# EasyEDA Pro project load_module.epro

# Schematic Adapter Tester Load Module
Board Name: Load Module; Create Date: 2025-03-27; Page Name: P1; Project Name: Adapter Tester; Schematic Name: Adapter Tester Load Module; Update Date: 2025-04-22; Company: FIIT STU; Page Size: A4; Version: V6.1
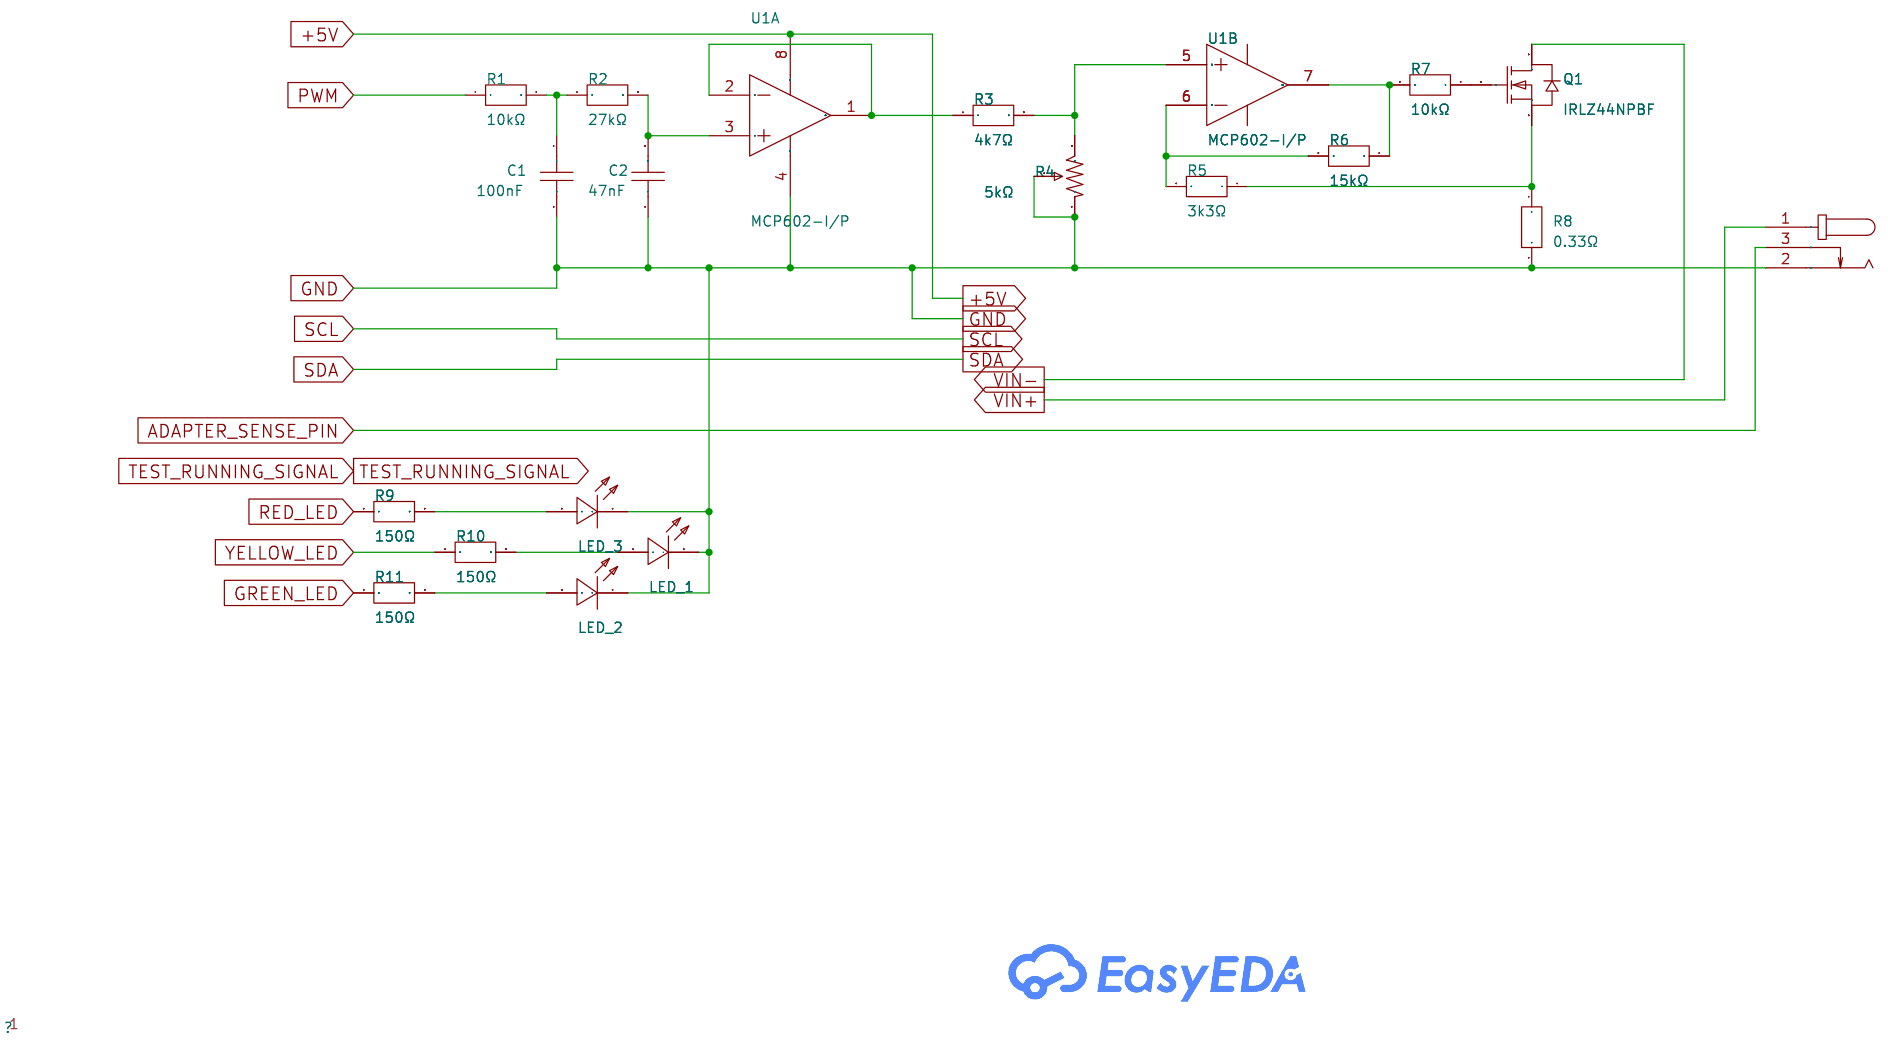
[diagram p0: schematic sheet]

## Parts
BARREL_PLUG  BARREL_PLUG  [DC-IN-TH_DC-005-2]
C1  100nF  [CAP-TH_L5.8-W2.4-P2.54-D0.6]
C2  47nF  [CAP-TH_L5.8-W2.4-P2.54-D0.6]
LED1  LED_1  [LED0805-R-RD]
LED_2  LED_2  [LED0603-RD]
LED_3  LED_3  [LED0603-RD]
Q1  IRLZ44NPBF  [TO-220-3_L10.0-W4.5-P2.54-T]
R1  10kΩ  [RES-TH_BD3.9-L9.0-P13.00-D0.8]
R2  27kΩ  [RES-TH_BD3.9-L9.0-P13.00-D0.8]
R3  4k7Ω  [RES-TH_BD3.9-L9.0-P13.00-D0.8]
R4  5kΩ  [RES-ADJ-TH_3P-L5.0-W4.5_ST-4ECXXX]
R5  3k3Ω  [RES-TH_BD3.9-L9.0-P13.00-D0.8]
R6  15kΩ  [RES-TH_BD3.9-L9.0-P13.00-D0.8]
R7  10kΩ  [RES-TH_BD3.9-L9.0-P13.00-D0.8]
R8  0.33Ω  [RES-TH_BD3.9-L9.0-P13.00-D0.8]
R9  150Ω  [RES-TH_BD3.9-L9.0-P13.00-D0.8]
R10  150Ω  [RES-TH_BD3.9-L9.0-P13.00-D0.8]
R11  150Ω  [RES-TH_BD3.9-L9.0-P13.00-D0.8]
U1  MCP602-I/P  [PDIP-8_L10.2-W6.5-P2.54-LS7.6-BL]  (sections 1,2)

## Library data of the parts
BARREL_PLUG = DC-005-5.5*2.1: Supplier Part: C9900017044; Supplier Footprint: DC-005; JLCPCB Part Class: Extended Part; Supplier: LCSC
C1 C2 = CC1H104ZA1PD3F5O3100: Capacitance:100nF Tolerance:-20%~+80% Tolerance:-20%~+80% Voltage Rated: Lead Spacing: Temperature Coefficient: φD: Body Thickness:2.7mm; LCSC Part Name: 100nF -20%~+80% 50V; Supplier Part: C5442938; Manufacturer: Dersonic(德尔创); Supplier Footprint: 插件,P=2.54mm; JLCPCB Part Class: Extended Part; Datasheet: https://atta.szlcsc.com/upload/public/pdf/source/20240808/A1D643912CF02E8A3453BB78D66C3C25.pdf; Supplier: LCSC; Tolerance: -20%~+80%; Body Thickness: 2.7mm
LED1 = KT-0805Y: Emitted Color:Yellow Power Dissipation:- Forward Current:- Dominant Wavelength:- Dominant Wavelength:- Peak Wavelength:- Diode Configuration:- Lens Color:- Color Temperature:- Color Temperature:- Viewing Angle:- Mounting Sytle:- Operating Temperature:- Op; LCSC Part Name: 0805 黄灯 高亮; Supplier Part: C2296; Manufacturer: KENTO; Supplier Footprint: 0805; JLCPCB Part Class: Basic Part; Datasheet: https://atta.szlcsc.com/upload/public/pdf/source/20160421/1461205044170.pdf; Supplier: LCSC; Emitted Color: Yellow
LED_2 LED_3 = KT-0603R: Emitted Color:Red Power Dissipation:- Forward Current:- Dominant Wavelength:- Dominant Wavelength:- Peak Wavelength:- Diode Configuration:- Lens Color:- Color Temperature:- Color Temperature:- Viewing Angle:- Mounting Sytle:- Operating Temperature:-40℃~+8; LCSC Part Name: 0603 红灯 高亮; Supplier Part: C2286; Manufacturer: KENTO; Supplier Footprint: 0603; JLCPCB Part Class: Basic Part; Datasheet: https://atta.szlcsc.com/upload/public/pdf/source/20160616/1466072038404.pdf; Supplier: LCSC; Emitted Color: Red; Operating Temperature: -40℃~+85℃
Q1 = IRLZ44NPBF: Type:1 N-Channel Drain Source Voltage (Vdss): Continuous Drain Current (Id): Drain Source On Resistance (RDS(on)@Vgs,Id):0.025Ω@5.0V,25A Power Dissipation (Pd): Gate Threshold Voltage (Vgs(th)@Id):1V@250uA Total Gate Charge (Qg@Vgs):48nC Input Capacitance; LCSC Part Name: 1个N沟道 耐压:55V 电流:47A; Supplier Part: C38774; Manufacturer: Infineon(英飞凌); Supplier Footprint: TO-220AB; JLCPCB Part Class: Extended Part; Datasheet: https://atta.szlcsc.com/upload/public/pdf/source/20141125/1457707250505.pdf; Supplier: LCSC; Type: 1 N-Channel; Drain Source On Resistance (RDS(on)@Vgs,Id): 0.025Ω@5.0V,25A; Gate Threshold Voltage (Vgs(th)@Id): 1V@250uA; Total Gate Charge (Qg@Vgs): 48nC; Input Capacitance (Ciss@Vds): 1.7nF; Reverse Transfer Capacitance (Crss@Vds): 150pF; Operating Temperature: -55℃~+175℃
R1-R3 R5-R11 = FMP200FBE52-11K: Type:Metal Film Resistors Resistance:11kΩ Tolerance:±1% Tolerance:±1% Power(Watts):2W Temperature Coefficient:±50ppm/℃ Temperature Coefficient:±50ppm/℃ Operating Temperature:-55℃~+155℃ Operating Temperature:-55℃~+155℃; LCSC Part Name: 金属膜电阻 11kΩ ±1% 2W; Supplier Part: C1381389; Manufacturer: YAGEO(国巨); Supplier Footprint: 插件,D3.9xL9mm; JLCPCB Part Class: Extended Part; Datasheet: https://atta.szlcsc.com/upload/public/pdf/source/20201103/C914809_0FD47FD0CF8094ED124D19117FE060E1.pdf; Supplier: LCSC; Type: Metal Film Resistors; Tolerance: ±1%; Power(Watts): 2W; Temperature Coefficient: ±50ppm/℃; Operating Temperature: -55℃~+155℃
R4 = ST-42EC502: Resistance:5kΩ Tolerance:±20% Tolerance:±20% Power(Watts):0.25W Temperature Coefficient:±100ppm/℃ Temperature Coefficient:±100ppm/℃ Number of Turns:; LCSC Part Name: 5kΩ ±20%; Supplier Part: C7322415; Manufacturer: NIDEC(尼得科); Supplier Footprint: 插件; JLCPCB Part Class: Extended Part; Datasheet: https://atta.szlcsc.com/upload/public/pdf/source/231023/st-4.pdf-0aa63f559c046985194fcb42fa26b14b.pdf; Supplier: LCSC; Tolerance: ±20%; Power(Watts): 0.25W; Temperature Coefficient: ±100ppm/℃
U1 = MCP602-I/P: Number of Circuits:双路 Gain Bandwidth Product(GBP):2.8MHz Current - Input Bias(Ib):1pA Slew Rate(SR):2.3V/us Output Current:22mA -3db Bandwidth:- Output Type:- Rail to Rail:- Operating Temperature:-40℃~+85℃ Operating Temperature:-40℃~+85℃; Supplier Part: C640402; Manufacturer: MICROCHIP(美国微芯); Supplier Footprint: PDIP-8; JLCPCB Part Class: Extended Part; Datasheet: https://atta.szlcsc.com/upload/public/pdf/source/20200709/C640402_411BEB0B9160A10FACDB2D346531642E.pdf; Supplier: LCSC; Number of Circuits: 双路; Gain Bandwidth Product(GBP): 2.8MHz; Current - Input Bias(Ib): 1pA; Slew Rate(SR): 2.3V/us; Output Current: 22mA; Operating Temperature: -40℃~+85℃

## Nets
+5V: U1.8(VDD)
GND: BARREL_PLUG.2 C1.2 C2.1 LED1.2(-) LED_2.1(K) LED_3.1(K) R4.1 R4.2 R8.2 U1.4(VSS)
VIN+: BARREL_PLUG.1
VIN-: Q1.2(D)
ADAPTER_SENSE_PIN: BARREL_PLUG.3
GREEN_LED: R11.1
PWM: R1.1
RED_LED: R9.1
YELLOW_LED: R10.1
$1N5473: C1.1 R1.2 R2.1
$1N5911: R3.1 U1.1(OUTA) U1.2(INA-)
$1N6087: R3.2 R4.3 U1.5(INB+)
$1N6622: R5.2 R6.2 U1.6(INB-)
$1N6676: R6.1 R7.2 U1.7(OUTB)
$1N6802: Q1.1(G) R7.1
$1N7065: Q1.3(S) R5.1 R8.1
$1N7235: LED1.1(+) R10.2
$1N7867: C2.2 R2.2 U1.3(INA+)
Net-(LED_2-2): LED_2.2(A) R11.2
Net-(LED_3-2): LED_3.2(A) R9.2

# Schematic Old Load Module
Create Date: 2025-05-05; Page Name: P1; Project Name: Adapter Tester; Schematic Name: Old Load Module; Update Date: 2025-05-05; Company: EasyEDA.com; Page Size: A4; Version: V1.0
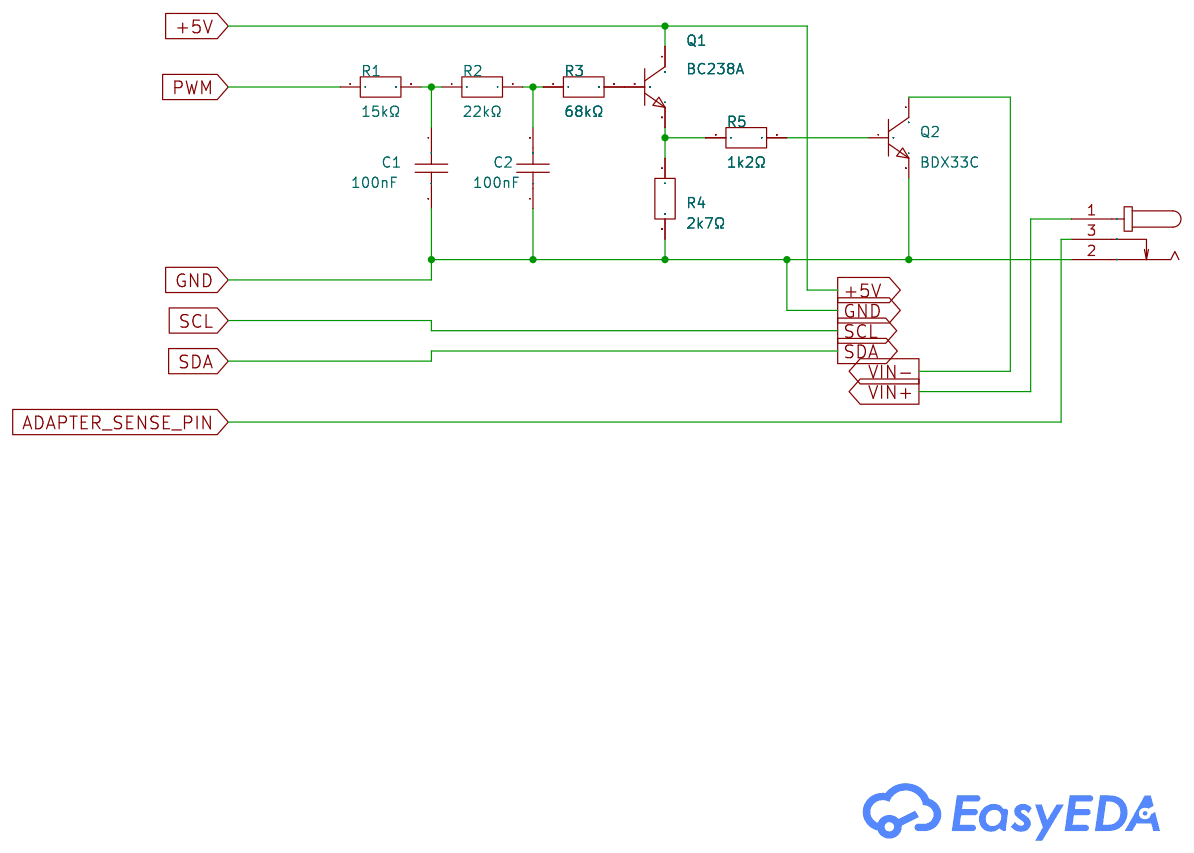
[diagram p1: schematic sheet]

## Parts
BARREL_PLUG1  BARREL_PLUG  [DC-IN-TH_DC-005-2]
C1  100nF  [CAP-TH_L5.8-W2.4-P2.54-D0.6]
C2  100nF  [CAP-TH_L5.8-W2.4-P2.54-D0.6]
Q1  BC238A  [TO-92-3_L4.8-W3.7-P1.27-L-1]
Q2  BDX33C  [TO-220-3_L10.0-W4.5-P2.54-L]
R1  15kΩ  [RES-TH_BD3.9-L9.0-P13.00-D0.8]
R2  22kΩ  [RES-TH_BD3.9-L9.0-P13.00-D0.8]
R3  68kΩ  [RES-TH_BD3.9-L9.0-P13.00-D0.8]
R4  2k7Ω  [RES-TH_BD3.9-L9.0-P13.00-D0.8]
R5  1k2Ω  [RES-TH_BD3.9-L9.0-P13.00-D0.8]

## Library data of the parts
BARREL_PLUG1 = DC-005-5.5*2.1: Supplier Part: C9900017044; Supplier Footprint: DC-005; JLCPCB Part Class: Extended Part; Supplier: LCSC
C1 C2 = CC1H104ZA1PD3F5O3100: Capacitance:100nF Tolerance:-20%~+80% Tolerance:-20%~+80% Voltage Rated: Lead Spacing: Temperature Coefficient: φD: Body Thickness:2.7mm; LCSC Part Name: 100nF -20%~+80% 50V; Supplier Part: C5442938; Manufacturer: Dersonic(德尔创); Supplier Footprint: 插件,P=2.54mm; JLCPCB Part Class: Extended Part; Datasheet: https://atta.szlcsc.com/upload/public/pdf/source/20240808/A1D643912CF02E8A3453BB78D66C3C25.pdf; Supplier: LCSC; Tolerance: -20%~+80%; Body Thickness: 2.7mm
Q1 = BC238A: Transistor type: Collector Current (Ic): Collector-Emitter Breakdown Voltage (Vceo): Power Dissipation (Pd): DC Current Gain (hFE@Ic,Vce):120@2mA,5V DC Current Gain (hFE@Ic,Vce):120@2mA,5V Transition Frequency (fT):250MHz Collector Cut-Off Current (Icbo):; Supplier Part: C3201868; Manufacturer: onsemi(安森美); Supplier Footprint: TO-92-3; JLCPCB Part Class: Extended Part; Datasheet: https://atta.szlcsc.com/upload/public/pdf/source/20230915/4ADCA7102CA9D64A631B24E57EEB097E.pdf; Supplier: LCSC; DC Current Gain (hFE@Ic,Vce): 120@2mA,5V; Transition Frequency (fT): 250MHz; Collector Cut-Off Current (Icbo): 15nA; Collector-Emitter Saturation Voltage (VCE(sat)@Ic,Ib): 600mV@100mA,5mA
Q2 = BDX33C: Supplier Part: C2907815; Manufacturer: SPTECH(深圳质超); Supplier Footprint: TO-220C; JLCPCB Part Class: Extended Part; Datasheet: https://atta.szlcsc.com/upload/public/pdf/source/20241108/8611D328D8F8F14D5B1655153493955F.pdf; Supplier: LCSC
R1-R5 = FMP200FBE52-11K: Type:Metal Film Resistors Resistance:11kΩ Tolerance:±1% Tolerance:±1% Power(Watts):2W Temperature Coefficient:±50ppm/℃ Temperature Coefficient:±50ppm/℃ Operating Temperature:-55℃~+155℃ Operating Temperature:-55℃~+155℃; LCSC Part Name: 金属膜电阻 11kΩ ±1% 2W; Supplier Part: C1381389; Manufacturer: YAGEO(国巨); Supplier Footprint: 插件,D3.9xL9mm; JLCPCB Part Class: Extended Part; Datasheet: https://atta.szlcsc.com/upload/public/pdf/source/20201103/C914809_0FD47FD0CF8094ED124D19117FE060E1.pdf; Supplier: LCSC; Type: Metal Film Resistors; Tolerance: ±1%; Power(Watts): 2W; Temperature Coefficient: ±50ppm/℃; Operating Temperature: -55℃~+155℃

## Nets
+5V: Q1.1(C)
GND: BARREL_PLUG1.2 C1.2 C2.1 Q2.3(E) R4.2
VIN+: BARREL_PLUG1.1
VIN-: Q2.2(C)
ADAPTER_SENSE_PIN: BARREL_PLUG1.3
PWM: R1.1
Net-(C1-1): C1.1 R1.2 R2.1
Net-(C2-2): C2.2 R2.2 R3.1
Net-(Q1-2): Q1.2(B) R3.2
Net-(Q1-3): Q1.3(E) R4.1 R5.1
Net-(Q2-1): Q2.1(B) R5.2

# Board PCB4
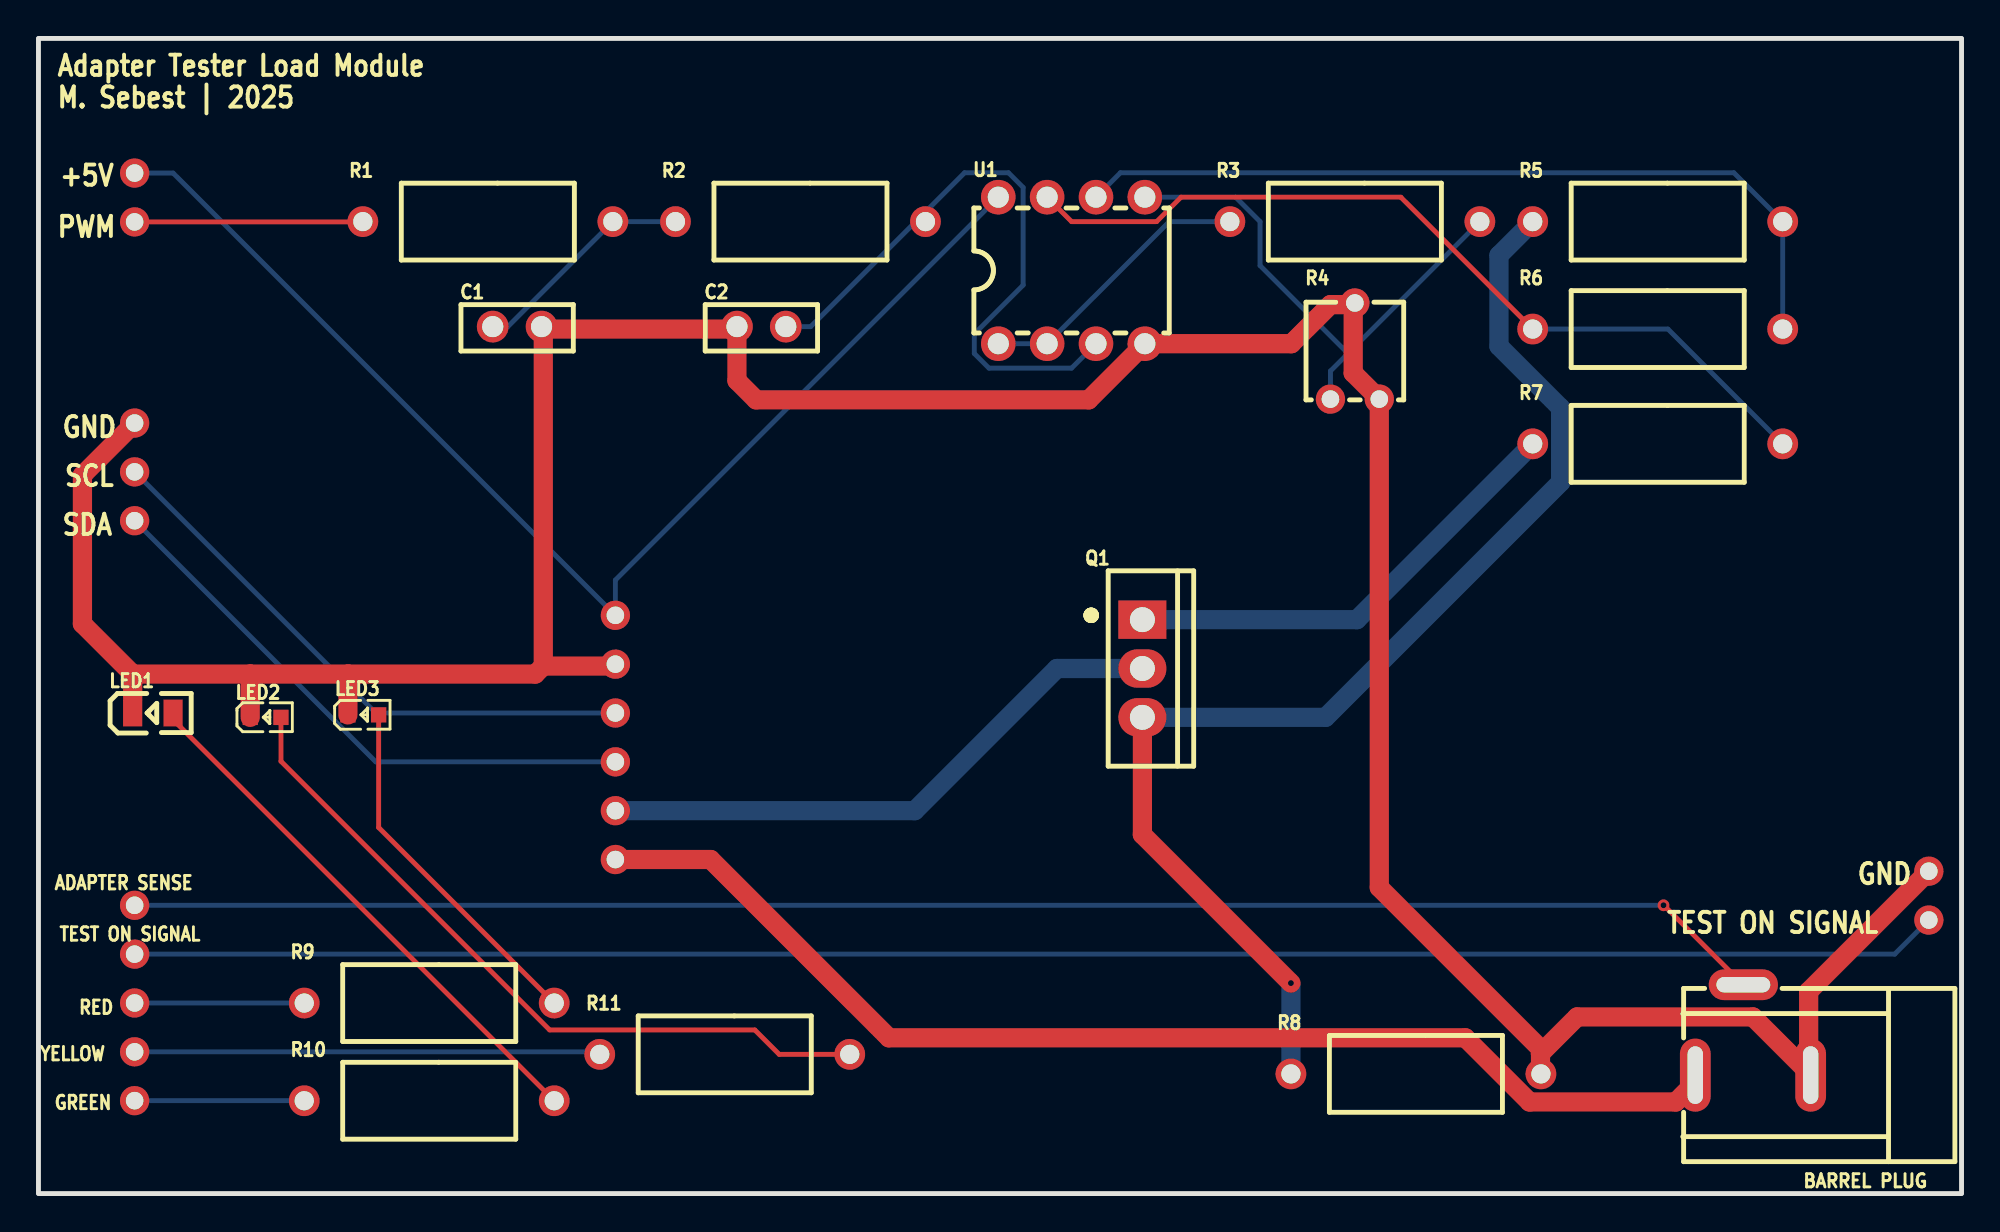
[diagram p2: board, top side]
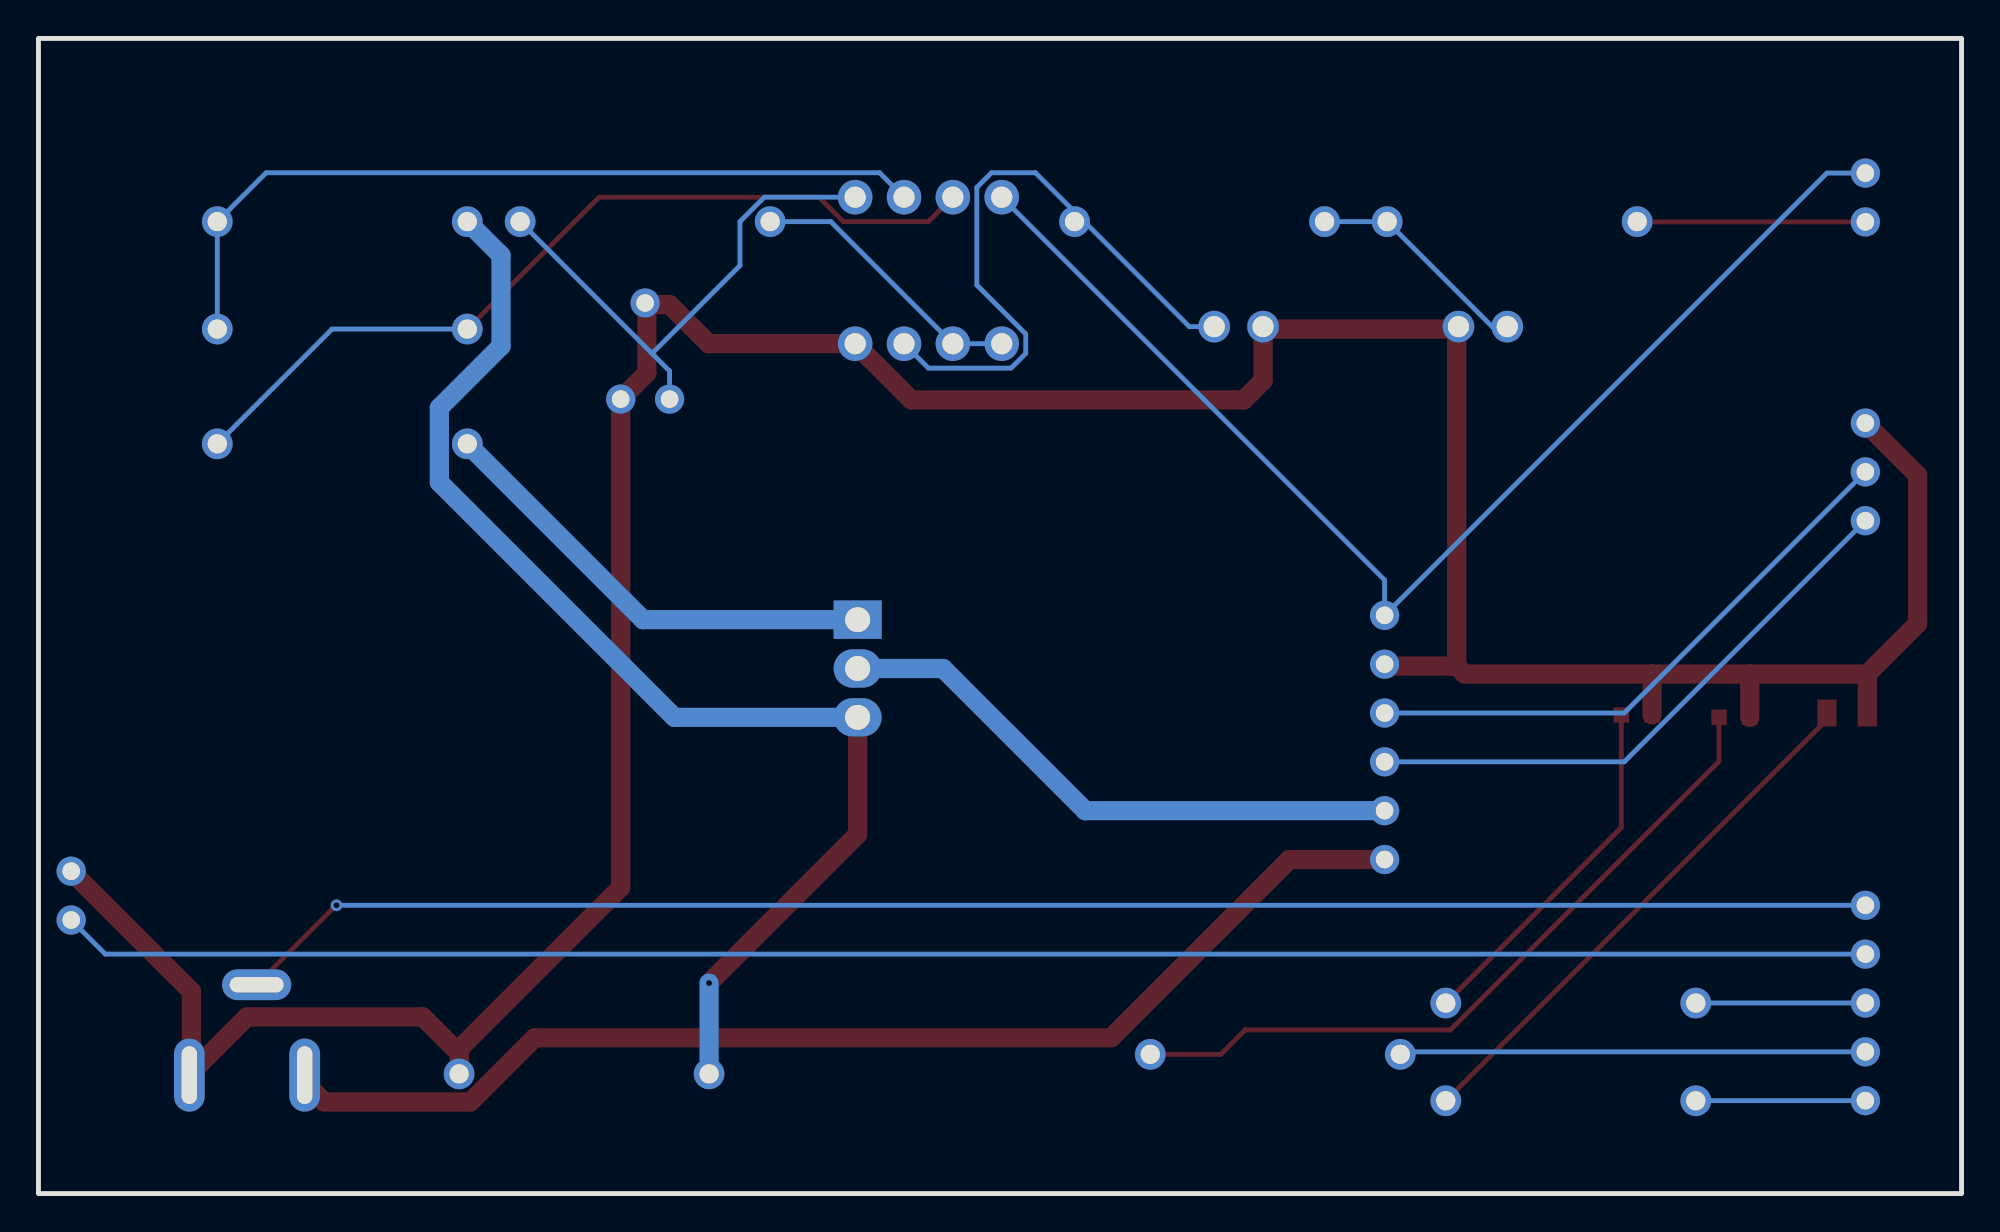
[diagram p3: board, bottom side, seen from below]

Outline 100 x 60.07 mm; copper layers: Top Layer, Bottom Layer. Coordinates in mm from the lower left corner of the outline.
Outline path: rectangle 0,60.07 100,0
Stack: Top Layer 0.035mm / Dielectric1 1.51mm FR4 er 4.5 / Bottom Layer 0.035mm

## Design rules (mm)
template: JLCPCB Capability(Two Layers Board)
spacing copperThickness1oz (default): track to track 0.102, other pairs 0.152 to 0.3
spacing copperThickness2oz: track to track 0.203, other pairs 0.152 to 0.3
track width copperThickness1oz (default): min 0.127, default 0.254, max 2.54
track width copperThickness2oz: min 0.203, default 0.254, max 2.54
differential pair differentialPair (default): width min 0.127, default 0.254, max 2.54; gap min 0.152, default 0.152
via viaSize (default): diameter min 0.5, default 0.61, max 10; hole min 0.3, default 0.305, max 6.3

## Placement (name value [footprint] x y rotation side)
BARREL PLUG  BARREL_PLUG  [DC-IN-TH_DC-005-2]  89.15 8.51 180 top
C1  100nF  [CAP-TH_L5.8-W2.4-P2.54-D0.6]  24.89 45.08 0 top
C2  47nF  [CAP-TH_L5.8-W2.4-P2.54-D0.6]  37.59 45.08 0 top
LED1  LED_1  [LED0805-R-RD]  5.95 24.99 0 top
LED2  LED_2  [LED0603-RD]  11.81 24.77 0 top
LED3  LED_3  [LED0603-RD]  16.89 24.89 0 top
NOREF  -  [Pad_e31]  5 7.37 0 top
NOREF#2  -  [Pad_e36]  5 37.53 0 top
NOREF#3  -  [Pad_e44]  30 19.91 0 top
NOREF#4  -  [Pad_e372]  98.3 16.76 0 top
NOREF#5  -  [Pad_e30]  5 9.91 0 top
NOREF#6  -  [Pad_e21]  5 53.07 0 top
NOREF#7  -  [Pad_e41]  30 30.07 0 top
NOREF#8  -  [Pad_e24]  5 40.07 0 top
NOREF#9  -  [Pad_e39]  98.3 14.22 0 top
NOREF#10  -  [Pad_e28]  5 14.99 0 top
NOREF#11  -  [Pad_e25]  30 24.99 0 top
NOREF#12  -  [Pad_e42]  30 27.53 0 top
NOREF#13  -  [Pad_e29]  5 12.45 0 top
NOREF#14  -  [Pad_e43]  30 17.37 0 top
NOREF#15  -  [Pad_e32]  5 4.83 0 top
NOREF#16  -  [Pad_e22]  5 50.53 0 top
NOREF#17  -  [Pad_e26]  30 22.45 0 top
NOREF#18  -  [Pad_e37]  5 34.99 0 top
Q1  IRLZ44NPBF  [TO-220-3_L10.0-W4.5-P2.54-T]  57.4 27.3 0 top
R1  10kΩ  [RES-TH_BD3.9-L9.0-P13.00-D0.8]  23.37 50.55 0 top
R2  27kΩ  [RES-TH_BD3.9-L9.0-P13.00-D0.8]  39.62 50.55 0 top
R3  4k7Ω  [RES-TH_BD3.9-L9.0-P13.00-D0.8]  68.45 50.55 0 top
R4  5kΩ  [RES-ADJ-TH_3P-L5.0-W4.5_ST-4ECXXX]  68.45 43.81 0 top
R5  3k3Ω  [RES-TH_BD3.9-L9.0-P13.00-D0.8]  84.2 50.55 0 top
R6  15kΩ  [RES-TH_BD3.9-L9.0-P13.00-D0.8]  84.2 44.96 0 top
R7  10kΩ  [RES-TH_BD3.9-L9.0-P13.00-D0.8]  84.2 38.99 0 top
R8  0.33Ω  [RES-TH_BD3.9-L9.0-P13.00-D0.8]  71.63 6.22 0 top
R9  150Ω  [RES-TH_BD3.9-L9.0-P13.00-D0.8]  20.32 9.91 0 top
R10  150Ω  [RES-TH_BD3.9-L9.0-P13.00-D0.8]  20.32 4.83 0 top
R11  150Ω  [RES-TH_BD3.9-L9.0-P13.00-D0.8]  35.69 7.24 0 top
U1  MCP602-I/P  [PDIP-8_L10.2-W6.5-P2.54-LS7.6-BL]  53.72 48.01 0 top

## Footprints (pads in the part's own frame, mm; a bottom-side part is the same pattern mirrored in y, then rotated)
CAP-TH_L5.8-W2.4-P2.54-D0.6
  round 1.65 hole 1.1: 1(-1.27,0) 2(1.27,0)
DC-IN-TH_DC-005-2
  oval 1.6x3.8 hole 0.8x3: 1(2.999,2.35) 2(-3,2.35)
  oval 3.6x1.6 hole 2.8x0.8: 3(0.5,-2.35)
LED0603-RD
  rect 0.8x0.8 smd: 1(-0.799,0) 2(0.799,0)
LED0805-R-RD
  rect 1x1.399 smd: 1(1.05,0) 2(-1.05,0)
Pad_e21
  round 1.524 hole 0.914: (0,0)
Pad_e22
  round 1.524 hole 0.914: (0,0)
Pad_e24
  round 1.524 hole 0.914: (0,0)
Pad_e25
  round 1.524 hole 0.914: (0,0)
Pad_e26
  round 1.524 hole 0.914: (0,0)
Pad_e28
  round 1.524 hole 0.914: (0,0)
Pad_e29
  round 1.524 hole 0.914: (0,0)
Pad_e30
  round 1.524 hole 0.914: (0,0)
Pad_e31
  round 1.524 hole 0.914: (0,0)
Pad_e32
  round 1.524 hole 0.914: (0,0)
Pad_e36
  round 1.524 hole 0.914: (0,0)
Pad_e37
  round 1.524 hole 0.914: (0,0)
Pad_e39
  round 1.524 hole 0.914: (0,0)
Pad_e41
  round 1.524 hole 0.914: (0,0)
Pad_e42
  round 1.524 hole 0.914: (0,0)
Pad_e43
  round 1.524 hole 0.914: (0,0)
Pad_e44
  round 1.524 hole 0.914: (0,0)
Pad_e372
  round 1.524 hole 0.914: (0,0)
PDIP-8_L10.2-W6.5-P2.54-LS7.6-BL
  round 1.8 hole 1.1: 1(-3.81,-3.81) 2(-1.27,-3.81) 3(1.27,-3.81) 4(3.81,-3.81) 5(3.81,3.81) 6(1.27,3.81) 7(-1.27,3.81) 8(-3.81,3.81)
RES-ADJ-TH_3P-L5.0-W4.5_ST-4ECXXX
  round 1.524 hole 0.914: 1(1.27,-2.5) 2(0,2.5) 3(-1.27,-2.5)
RES-TH_BD3.9-L9.0-P13.00-D0.8
  round 1.6 hole 1: 1(-6.5,0) 2(6.5,0)
TO-220-3_L10.0-W4.5-P2.54-T
  rect 2.5x2 hole 1.3: 1(0,2.54)
  oval 2.5x2 hole 1.3: 2(0,0) 3(0,-2.54)

## Nets
+5V: NOREF#6. NOREF#7. U1.8
GND: BARREL PLUG.2 C1.2 C2.1 LED1.2 LED2.1 LED3.1 NOREF#4. NOREF#8. NOREF#12. R4.1 R4.2 R8.2 U1.4
VIN+: BARREL PLUG.1 NOREF#14.
VIN-: NOREF#3. Q1.2
ADAPTER_SENSE_PIN: BARREL PLUG.3 NOREF#10.
GREEN_LED: NOREF. R11.1
PWM: NOREF#16. R1.1
RED_LED: NOREF#5. R9.1
SCL: NOREF#2. NOREF#11.
SDA: NOREF#17. NOREF#18.
TEST_RUNNING_SIGNAL: NOREF#9. NOREF#13.
YELLOW_LED: NOREF#15. R10.1
$1N5473: C1.1 R1.2 R2.1
$1N5911: R3.1 U1.1 U1.2
$1N6087: R3.2 R4.3 U1.5
$1N6622: R5.2 R6.2 U1.6
$1N6676: R6.1 R7.2 U1.7
$1N6802: Q1.1 R7.1
$1N7065: Q1.3 R5.1 R8.1
$1N7235: LED1.1 R10.2
$1N7240: LED3.2 R9.2
$1N7245: LED2.2 R11.2
$1N7867: C2.2 R2.2 U1.3

## Via types
v1: diameter 0.61, hole 0.305, Top Layer to Bottom Layer, 2 vias

## Routing (per net, layer and track width the routed paths; a pad name or vN(x,y) marks a point on that pad's centre or on a via; arc(x,y) is an arc through that point)
+5V: length 64.5
  Bottom Layer w0.254: 5,53.07 7,53.07 30,30.07 30,31.91 U1.8
GND: length 185.3
  Top Layer w0.254: 78.1,6.77 78.1,6.25 R8.2 ; 26.25,44.96 C1.2 ; 68.37,46.23 R4.2 ; LED1.2 4.9,25.75
  Top Layer w1: 4.9,27.02 11.02,27.02 ; 4.9,27.02 4.9,25.75 ; 4.9,27.02 2.29,29.63 2.29,37.36 5,40.07 ; 11.02,27.02 16.1,27.02 ; 11.02,27.02 11.01,27.01 LED2.1 ; 26.25,27.43 25.84,27.02 16.1,27.02 ; 26.25,27.43 26.25,44.96 36.19,44.96 C2.1 36.32,42.27 37.32,41.27 54.61,41.27 U1.4 65.15,44.2 67.18,46.23 68.37,46.23 68.37,42.67 R4.1 69.72,15.91 78.1,7.53 78.1,7.28 ; 26.25,27.43 29.9,27.43 30,27.53 ; 78.1,7.28 78.1,6.77 ; 78.1,7.28 80.01,9.18 89.15,9.18 92.05,6.29 ; 16.1,27.02 16.09,27 LED3.1 ; 92.05,6.26 92.05,6.29 ; 92.05,6.29 92.05,10.52 98.3,16.76
VIN+: length 62.2
  Top Layer w1: BARREL PLUG.1 86.15,5.78 85.14,4.76 77.53,4.76 74.2,8.1 44.22,8.1 34.95,17.37 30,17.37
VIN-: length 30.5
  Bottom Layer w1: 30,19.91 45.56,19.91 52.96,27.3 Q1.2
ADAPTER_SENSE_PIN: length 85.4
  Top Layer w0.254: BARREL PLUG.3 84.52,14.99 v1(84.5,14.99)
  Bottom Layer w0.254: 5,14.99 v1(84.5,14.99)
GREEN_LED: length 24.2
  Bottom Layer w0.254: 5,7.37 29.06,7.37 R11.1
PWM: length 11.9
  Top Layer w0.254: 5,50.53 16.85,50.53 R1.1
RED_LED: length 8.8
  Bottom Layer w0.254: 5,9.91 13.81,9.91
SCL: length 30.2
  Bottom Layer w0.254: 30,24.99 17.54,24.99 5,37.53
SDA: length 30.2
  Bottom Layer w0.254: 30,22.45 17.54,22.45 5,34.99
TEST_RUNNING_SIGNAL: length 94
  Bottom Layer w0.254: 5,12.45 96.53,12.45 98.3,14.22
YELLOW_LED: length 8.8
  Bottom Layer w0.254: 5,4.83 13.81,4.83
$1N5473: length 11.3
  Bottom Layer w0.254: C1.1 24.41,45.08 R1.2 32.62,50.55
$1N5911: length 14.7
  Bottom Layer w0.254: R3.1 58.8,50.55 U1.2 U1.1
$1N6087: length 27.7
  Bottom Layer w0.254: R3.2 68.09,43.69 ; 68.09,43.69 63.52,48.26 63.52,50.55 62.25,51.82 U1.5 ; 68.09,43.69 67.18,42.78 R4.3
$1N6622: length 42.9
  Bottom Layer w0.254: R6.2 R5.2 88.16,53.09 56.26,53.09 U1.6
$1N6676: length 44.6
  Top Layer w0.254: R6.1 70.84,51.82 59.41,51.82 58.14,50.55 53.72,50.55 U1.7
  Bottom Layer w0.254: R7.2 84.73,44.96 R6.1
$1N6802: length 24.1
  Bottom Layer w1: R7.1 68.56,29.84 Q1.1
$1N7065: length 64.2
  Top Layer w1: v1(65.13,10.94) 57.4,18.67 Q1.3
  Bottom Layer w1: R5.1 75.95,48.79 75.95,44.07 79.15,40.86 79.15,36.99 66.93,24.77 Q1.3 ; v1(65.13,10.94) R8.1
$1N7235: length 28.4
  Top Layer w0.254: LED1.1 7,24.65 R10.2
$1N7240: length 18.8
  Top Layer w0.254: R9.2 17.69,19.04 LED3.2
$1N7245: length 38.2
  Top Layer w0.254: LED2.2 12.61,22.48 26.58,8.51 37.25,8.51 38.52,7.24 R11.2
$1N7867: length 32.8
  Bottom Layer w0.254: C2.2 40.16,45.08 48.16,53.09 50.44,53.09 51.2,52.32 51.2,47.24 48.66,44.7 48.66,43.69 49.43,42.93 53.72,42.93 U1.3

## Text on the board
Top Silkscreen Layer: YELLOW | ADAPTER SENSE | GREEN | TEST ON SIGNAL | RED | Adapter Tester Load Module | M. Sebest | 2025 | PWM | +5V | GND | SDA | SCL
